# Altium schematic sheet Overview.SchDoc
size A4; SheetNumber: 1; SheetTotal: 8
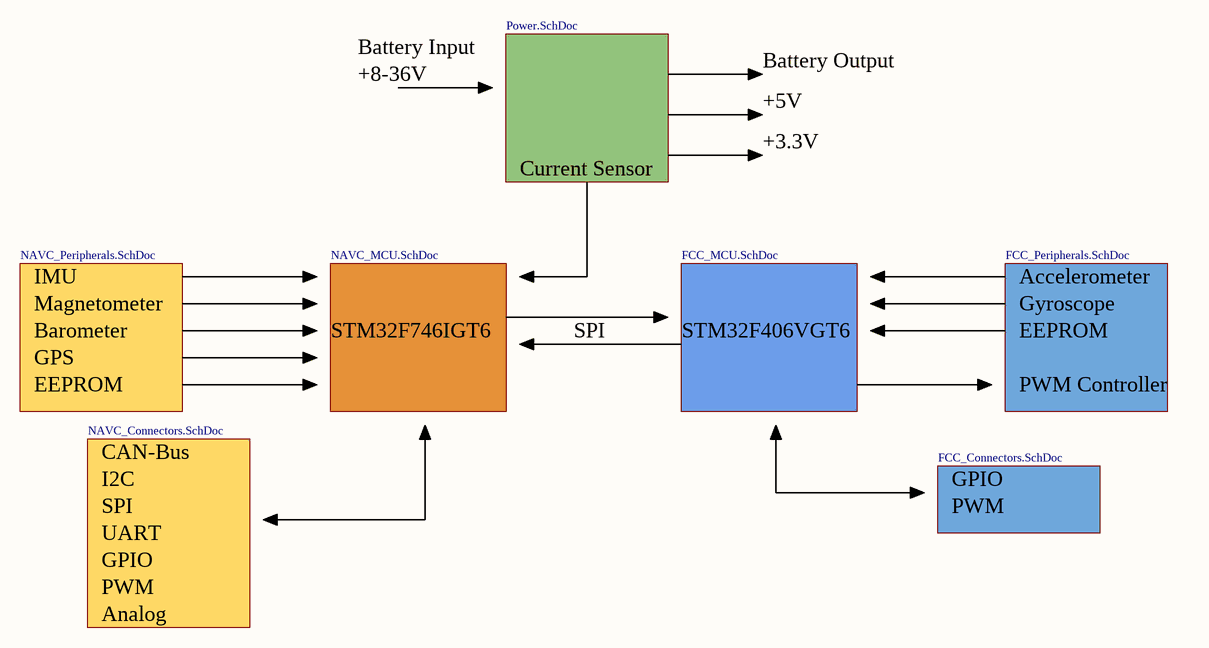
[diagram p0: Overview.SchDoc]

## Sub-sheets
Designator = FCC_Connectors.SchDoc: no entries
Designator = FCC_Peripherals.SchDoc: no entries
Designator = NAVC_MCU.SchDoc: no entries
Designator = NAVC_Peripherals.SchDoc: no entries
Designator = NAVC_Connectors.SchDoc: no entries
Designator = FCC_MCU.SchDoc: no entries
Designator = Power.SchDoc: no entries

## Notes on the sheet
- +8-36V
- Battery Input
- +5V
- Battery Output
- Current Sensor
- +3.3V
- IMU
- Magnetometer
- Accelerometer
- Gyroscope
- Barometer
- GPS
- STM32F746IGT6
- SPI
- STM32F406VGT6
- EEPROM
- PWM Controller
- CAN-Bus
- I2C
- GPIO
- PWM
- UART
- Analog